# Altium schematic sheet Energy Harvesting.SchDoc
size A4; Date: 09-12-2022; Engineer: Christian Peppelman; Revision: V200; SheetNumber: 2; SheetTotal: 2; ProjectSheetName: Dental Sensor Hardware Demonstrator; SheetName: Energy Harvesting
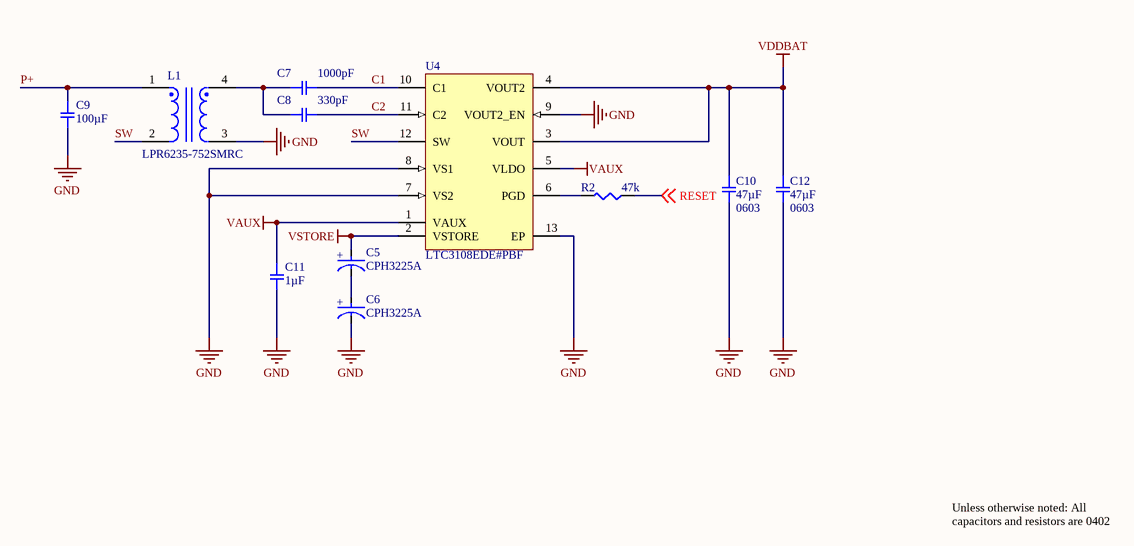
[diagram p0: Energy Harvesting.SchDoc]

## Parts
C5  CPH3225A  [CPH3225A]
C6  CPH3225A  [CPH3225A]
C7  1000pF  [CAPC1005X03N]
C8  330pF  [CAPC1005X03N]
C9  100µF  [CAPC2012X12N]
C10  47µF  Package / Case: 0603  [CAPC1608X12N]
C11  1µF  [CAPC1005X03N]
C12  47µF  Package / Case: 0603  [CAPC1608X12N]
L1  LPR6235-752SMRC  [LPR6235]
R2  47k  [CAPC1005X03N]
U4  LTC3108EDE#PBF  [LT-DE-12-05-08-1708_V]

## Nets
GND: C6.2(A) C9.2 C10.2 C11.2 C12.2 L1.3 U4.7(VS2) U4.8(VS1) U4.9(VOUT2_EN) U4.13(EP)
VAUX: C11.1 U4.1(VAUX) U4.5(VLDO)
VDDBAT: C10.1 C12.1 U4.3(VOUT) U4.4(VOUT2)
VSTORE: C5.1(C) U4.2(VSTORE)
C1: C7.2 U4.10(C1)
C2: C8.2 U4.11(C2)
P+: C9.1 L1.1
RESET: R2.1 ; off-sheet RESET
SW: L1.2 U4.12(SW)
NetC5_2: C5.2(A) C6.1(C)
NetC7_1: C7.1 C8.1 L1.4
NetR2_2: R2.2 U4.6(PGD)

## Notes on the sheet
- Unless otherwise noted: All capacitors and resistors are 0402
- Embedded and
- Networked System
- ENGINEER:
- DATE:
- REVISION:
- SIZE: A4
- (in symbol CPH3225A) +

## Library data of the parts
C5 C6 = CPH3225A: Supercapacitors / Ultracapacitors Reflow EDLC 3.3V, 11mF, 160 Ohm
C7 = GRM155R61C102KA01D: CAP CER 1000PF 16V X5R 0402; Manufacturer: Murata Electronics North America; Factory Stock: 0; Unit Price (USD): 0.1; Minimum Quantity: 1; Tolerance: ±10%; Datasheets: http://www.murata.com/~/media/webrenewal/support/library/catalog/products/capacitor/mlcc/c02e.pdf; Image: //media.digikey.com/Renders/Murata%20Renders/ZRB-SERIES-0402.jpg; Digi-Key Part Number: 490-6308-1-ND; Part Number: GRM155R61C102KA01D; Quantity Available: 57479; @ qty: 0; Packaging: Cut Tape (CT); Series: GRM; Part Status: Active; Value: 1000pF; Voltage: 16V; Temperature Coefficient: X5R; Operating Temperature: -55°C ~ 85°C; Features: -; Ratings: -; Applications: General Purpose; Mounting Type: Surface Mount, MLCC; Package / Case: 0402 (1005 Metric); Size / Dimension: 0.039" L x 0.020" W (1.00mm x 0.50mm); Height - Seated (Max): -; Thickness (Max): 0.022" (0.55mm); Lead Spacing: -
C8 = GRM155R71H331KA01J: CAP CER 330PF 50V X7R 0402; Manufacturer: Murata Electronics North America; Factory Stock: 0; Unit Price (USD): 0.1; Minimum Quantity: 1; Tolerance: ±10%; Datasheets: http://www.murata.com/~/media/webrenewal/support/library/catalog/products/capacitor/mlcc/c02e.pdf; Image: //media.digikey.com/Renders/Murata%20Renders/ZRB-SERIES-0402.jpg; Digi-Key Part Number: 490-11424-1-ND; Part Number: GRM155R71H331KA01J; Quantity Available: 47870; @ qty: 0; Packaging: Cut Tape (CT); Series: GRM; Part Status: Active; Value: 330pF; Voltage: 50V; Temperature Coefficient: X7R; Operating Temperature: -55°C ~ 125°C; Features: -; Ratings: -; Applications: General Purpose; Mounting Type: Surface Mount, MLCC; Package / Case: 0402 (1005 Metric); Size / Dimension: 0.039" L x 0.020" W (1.00mm x 0.50mm); Height - Seated (Max): -; Thickness (Max): 0.022" (0.55mm); Lead Spacing: -; Lead Style: -
C9 = GRM21BC80E107ME15L: CAP CER 100UF 2.5V X6S 0805; Manufacturer: Murata Electronics North America; Factory Stock: 0; Unit Price (USD): 2.17; Minimum Quantity: 1; Tolerance: ±20%; Datasheets: http://search.murata.co.jp/Ceramy/image/img/A01X/G101/ENG/GRM21BC80E107ME15-01.pdf; Image: //media.digikey.com/Renders/Murata%20Renders/0805%20(2012%20Metric)%20.85mm.jpg; Digi-Key Part Number: 490-13977-1-ND; Part Number: GRM21BC80E107ME15L; Quantity Available: 5990; @ qty: 0; Packaging: Cut Tape (CT); Series: GRM; Part Status: Active; Value: 100µF; Voltage: 2.5V; Temperature Coefficient: X6S; Operating Temperature: -55°C ~ 105°C; Features: -; Ratings: -; Applications: General Purpose; Mounting Type: Surface Mount, MLCC; Package / Case: 0805 (2012 Metric); Size / Dimension: 0.079" L x 0.049" W (2.00mm x 1.25mm); Height - Seated (Max): -; Thickness (Max): 0.057" (1.45mm); Lead Spacing: -; Lead Style: -
C10 C12 = GRJ155R60J106ME11D: CAP CER 47UF 6.3V X5R 0603; Manufacturer: Murata Electronics North America; Factory Stock: 0; Unit Price (USD): 0.23; Minimum Quantity: 1; Tolerance: ±20%; Datasheets: http://psearch.en.murata.com/capacitor/product/GRJ155R60J106ME11%23.pdf; Image: //media.digikey.com/Renders/Murata%20Renders/ZRB-SERIES-0402.jpg; Digi-Key Part Number: 490-13211-1-ND; Part Number: GRJ155R60J106ME11D; Quantity Available: 64064; @ qty: 0; Packaging: Cut Tape (CT); Series: GRJ; Part Status: Active; Value: 47µF; Voltage: 6.3V; Temperature Coefficient: X5R; Operating Temperature: -55°C ~ 85°C; Features: Derating Recommended, Soft Termination; Ratings: -; Applications: Boardflex Sensitive; Mounting Type: Surface Mount, MLCC; Size / Dimension: 0.039" L x 0.020" W (1.00mm x 0.50mm); Height - Seated (Max): -; Thickness (Max): 0.028" (0.70mm); Lead Spacing: -; Lead Style: -
C11 = GRT155R61C105KE01D: CAP CER 1UF 16V X5R 0402; Manufacturer: Murata Electronics North America; Factory Stock: 0; Unit Price (USD): 0.1; Minimum Quantity: 1; Tolerance: ±10%; Datasheets: http://search.murata.co.jp/Ceramy/image/img/A01X/G101/ENG/GRT155R61C105KE01-01.pdf; Image: //media.digikey.com/Renders/Murata%20Renders/ZRB-SERIES-0402.jpg; Digi-Key Part Number: 490-12255-1-ND; Part Number: GRT155R61C105KE01D; Quantity Available: 10000; @ qty: 0; Packaging: Cut Tape (CT); Series: GRT; Part Status: Active; Value: 1µF; Voltage: 16V; Temperature Coefficient: X5R; Operating Temperature: -55°C ~ 85°C; Features: -; Ratings: AEC-Q200; Applications: Automotive; Mounting Type: Surface Mount, MLCC; Package / Case: 0402 (1005 Metric); Size / Dimension: 0.039" L x 0.020" W (1.00mm x 0.50mm); Height - Seated (Max): -; Thickness (Max): 0.022" (0.55mm); Lead Spacing: -; Lead Style: -
L1 = LPR6235-752SMRC: Gekoppelde smoorspoelen 7.5uH 75% 1.6A 316 Ohms 1:100
R2 = ERJ-2RKF4702X: RES SMD 47K OHM 1% 1/10W 0402; Manufacturer: Panasonic Electronic Components; Factory Stock: 0; Unit Price (USD): 0.00496; @ qty: 1500; Minimum Quantity: 1; Power (Watts): 0.1W, 1/10W; Temperature Coefficient: ±100ppm/°C; Part Number: ERJ-2RKF4702X; Datasheets: http://industrial.panasonic.com/www-cgi/jvcr13pz.cgi?E+PZ+3+AOA0002+ERJ2RKF4702X+7+WW; Image: //media.digikey.com/Photos/Panasonic%20Photos/ERJ-PA2-Series.jpg; Digi-Key Part Number: P47.0KLCT-ND; Quantity Available: 230515; Packaging: Cut Tape (CT); Series: ERJ; Part Status: Active; Value: 47k; Tolerance: ±1%; Composition: Thick Film; Features: Automotive AEC-Q200; Operating Temperature: -55°C ~ 155°C; Package / Case: 0402 (1005 Metric); Supplier Device Package: 0402; Size / Dimension: 0.039" L x 0.020" W (1.00mm x 0.50mm); Height - Seated (Max): 0.016" (0.40mm); Number of Terminations: 2; Failure Rate: -
U4 = CMP-0473-00079-1: Ultralow Voltage Step-Up Converter and Power Manager, 12-pin SON (DE-12), -40 to 125 degC, Pb-Free; Manufacturer: Linear Technology; Energy Source: Thermoelectric; Vin Max(V): 0.5; Topology: Boost, LDO; Vout Max(V): 5; Number of Outputs: 3; Vin Min(V): 0.02; PackageDescription: 12-Pin Plastic DFN, Body 4 x 3 mm, Pitch 0.5 mm; ComponentLink3URL: http://cds.linear.com/docs/en/datasheet/3473f.pdf; PartNumber: LTC3108EDE#PBF; ComponentLink3Description: Package Specification; ComponentLink2URL: http://cds.linear.com/docs/en/datasheet/3108fb.pdf; PackageReference: DE-12; DatasheetVersion: Rev. B; Mounting Technology: Surface Mount; RoHS: TRUE; ComponentLink1Description: Manufacturer URL; ComponentLink1URL: http://www.linear.com/; ComponentLink2Description: Datasheet; Code_JEDEC: MO-229